# Altium project Adapter.PrjPCB
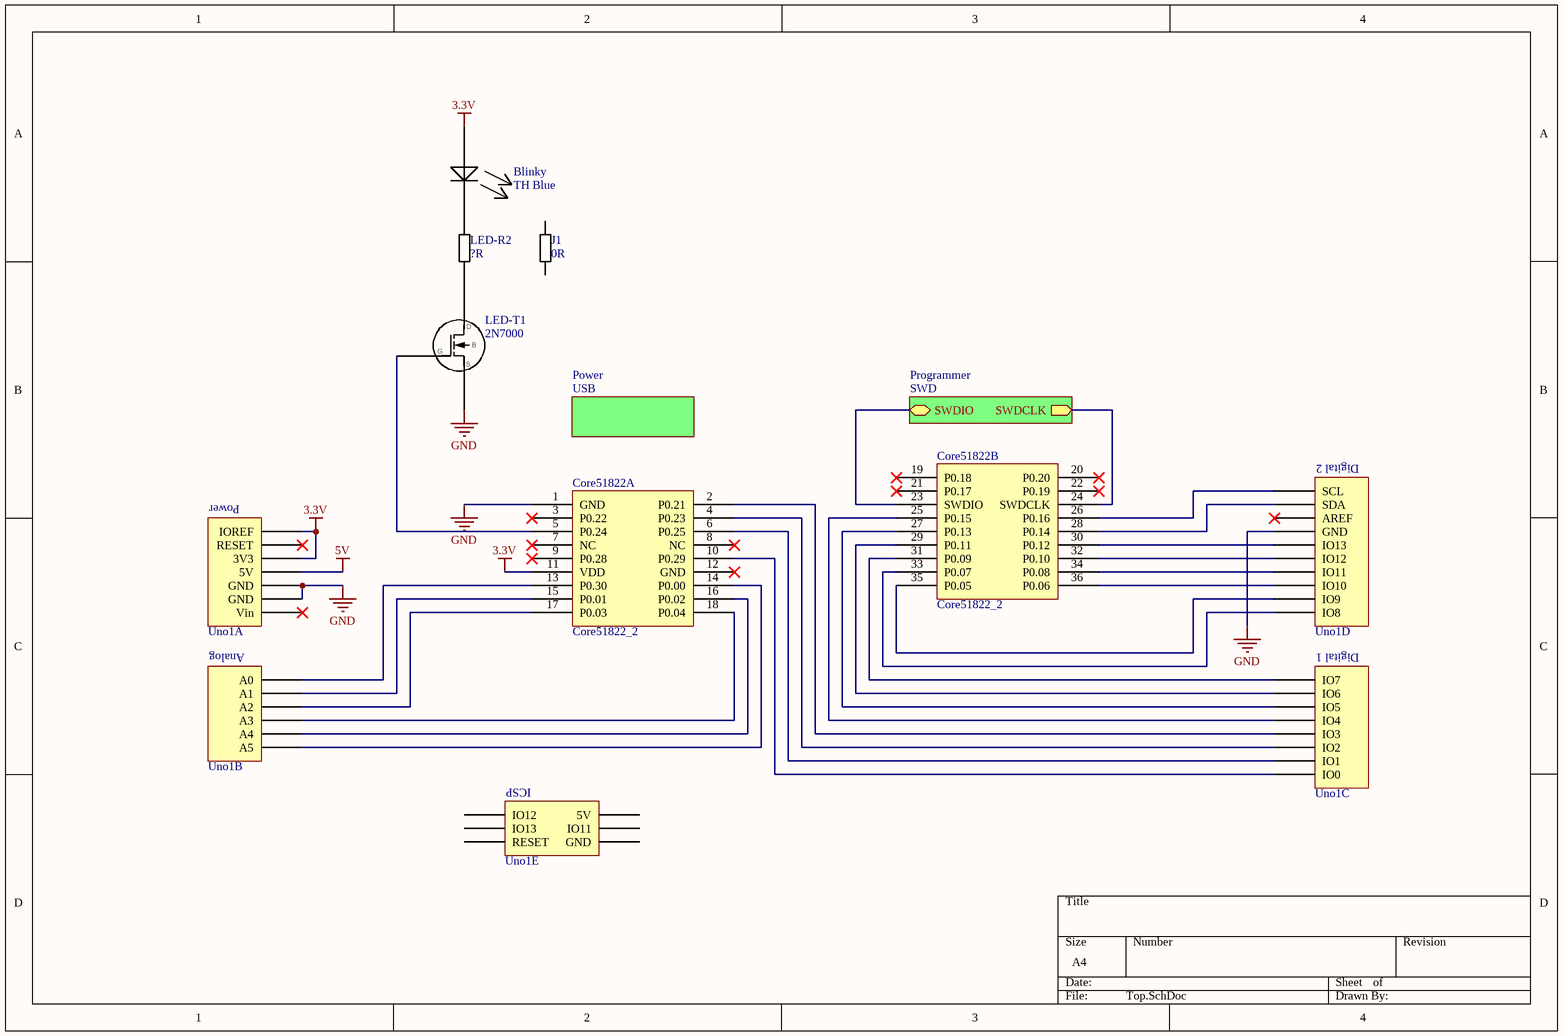
[diagram p0: Top.SchDoc]
4 sheets, 14 parts. Net scope: hierarchical (ports join the sheet entries above them; power ports are global).
Board file: DevBoard.PcbDoc
Sheets:
  Top.SchDoc
    USB = Power.SchDoc
      Voltage Regulator = LDO-3V3.SchDoc
  SWD resistor hack.SchDoc

## Sheet Top.SchDoc
size A4

### Parts
Blinky  TH Blue  [LED 3mm]
Core51822  Core51822_2  [Core51822]  (parts A,B of 2)
J1  0R  [R 0805 / 2012 wide]
LED-R2  ?R  [R 0805 / 2012]
LED-T1  2N7000  [SOT-23-3]
Uno1  Arduino Uno  [Arduino Uno Adapter]  (value not drawn)  (parts A,B,C,D,E of 5)

### Sub-sheets
Programmer = SWD (file not in this document): SWDCLK (out), SWDIO (bidir)
USB = Power: no entries

### Nets
3.3V: Blinky.1(+) Core51822.11(VDD) Uno1.3V3 Uno1.IOREF
5V: Uno1.5V
GND: Core51822.1(GND) LED-T1.2 Uno1.GND1(GND) Uno1.GND2(GND) Uno1.GND3(GND)
NetBlinky_2: Blinky.2(-) LED-R2.2
NetCore51822_2: Core51822.2(P0.21) Uno1.3(IO3)
NetCore51822_4: Core51822.4(P0.23) Uno1.2(IO2)
NetCore51822_5: Core51822.5(P0.24) LED-T1.1
NetCore51822_6: Core51822.6(P0.25) Uno1.1(IO1)
NetCore51822_10: Core51822.10(P0.29) Uno1.0(IO0)
NetCore51822_13: Core51822.13(P0.30) Uno1.A0
NetCore51822_14: Core51822.14(P0.00) Uno1.A5
NetCore51822_15: Core51822.15(P0.01) Uno1.A1
NetCore51822_16: Core51822.16(P0.02) Uno1.A4
NetCore51822_17: Core51822.17(P0.03) Uno1.A2
NetCore51822_18: Core51822.18(P0.04) Uno1.A3
NetCore51822_23: Core51822.23(SWDIO) ; sheet Programmer/SWDIO
NetCore51822_24: Core51822.24(SWDCLK) ; sheet Programmer/SWDCLK
NetCore51822_25: Core51822.25(P0.15) Uno1.4(IO4)
NetCore51822_26: Core51822.26(P0.16) Uno1.SCL
NetCore51822_27: Core51822.27(P0.13) Uno1.5(IO5)
NetCore51822_28: Core51822.28(P0.14) Uno1.SDA
NetCore51822_29: Core51822.29(P0.11) Uno1.6(IO6)
NetCore51822_30: Core51822.30(P0.12) Uno1.13(IO13)
NetCore51822_31: Core51822.31(P0.09) Uno1.7(IO7)
NetCore51822_32: Core51822.32(P0.10) Uno1.12(IO12)
NetCore51822_33: Core51822.33(P0.07) Uno1.8(IO8)
NetCore51822_34: Core51822.34(P0.08) Uno1.11(IO11)
NetCore51822_35: Core51822.35(P0.05) Uno1.9(IO9)
NetCore51822_36: Core51822.36(P0.06) Uno1.10(IO10)
NetLED-R2_1: LED-R2.1 LED-T1.3

Not connected (* = marked no-connect by the designer): Core51822 3(P0.22)* 7(NC)* 8(NC)* 9(P0.28)* 12(GND)* 19(P0.18)* 20(P0.20)* 21(P0.17)* 22(P0.19)*; J1 1 2; Uno1 AREF* ICSP1(IO12) ICSP2(5V) ICSP3(IO13) ICSP4(IO11) ICSP5(RESET) ICSP6(GND) RESET* Vin*

### Notes on the sheet
- (in symbol Arduino Uno, part A) Power
- (in symbol Arduino Uno, part B) Analog
- (in symbol Arduino Uno, part C) Digital 1
- (in symbol Arduino Uno, part D) Digital 2
- (in symbol Arduino Uno, part E) ICSP

### Library data of the parts
Blinky = LED
J1 LED-R2 = Resistor
LED-T1 = 2N7000: N-FET

## Sheet Power.SchDoc
size A4
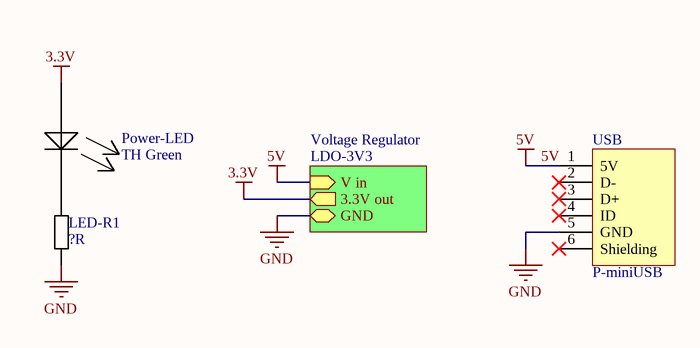
[diagram p1: Power.SchDoc]

### Parts
LED-R1  ?R  [R 0805 / 2012]
Power-LED  TH Green  [LED 3mm]
USB  P-miniUSB  [miniUSB]

### Sub-sheets
Voltage Regulator = LDO-3V3: 3.3V out (out), GND, V in (in)

### Nets
3.3V: Power-LED.1(+) ; sheet Voltage Regulator/3.3V out
5V: USB.1(5V) ; sheet Voltage Regulator/V in
GND: LED-R1.1 USB.5(GND) ; sheet Voltage Regulator/GND
NetLED-R1_2: LED-R1.2 Power-LED.2(-)

Not connected (* = marked no-connect by the designer): USB 2(D-)* 3(D+)* 4(ID)* 6(Shielding)*

### Library data of the parts
LED-R1 = Resistor
Power-LED = LED
USB = miniUSB

## Sheet LDO-3V3.SchDoc
size A4
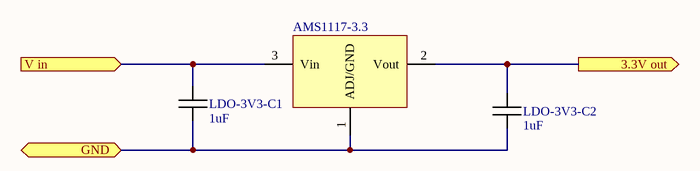
[diagram p2: LDO-3V3.SchDoc]

### Parts
AMS1117-3.3  AMS1117  [SOT-223-3]  (value not drawn)
LDO-3V3-C1  1uF  [C 0805 / 2012]
LDO-3V3-C2  1uF  [C 0805 / 2012]

### Ports
3.3V out (out), GND, V in (in)

### Nets
3.3V: AMS1117-3.3.2(Vout) LDO-3V3-C2.2 ; port 3.3V out
5V: AMS1117-3.3.3(Vin) LDO-3V3-C1.2 ; port V in
GND: AMS1117-3.3.1(ADJ/GND) LDO-3V3-C1.1 LDO-3V3-C2.1 ; port GND

### Library data of the parts
AMS1117-3.3 = AMS1117: LDO 3.3V/5V/12V
LDO-3V3-C1 LDO-3V3-C2 = Capacitor

## Sheet SWD resistor hack.SchDoc
size A4
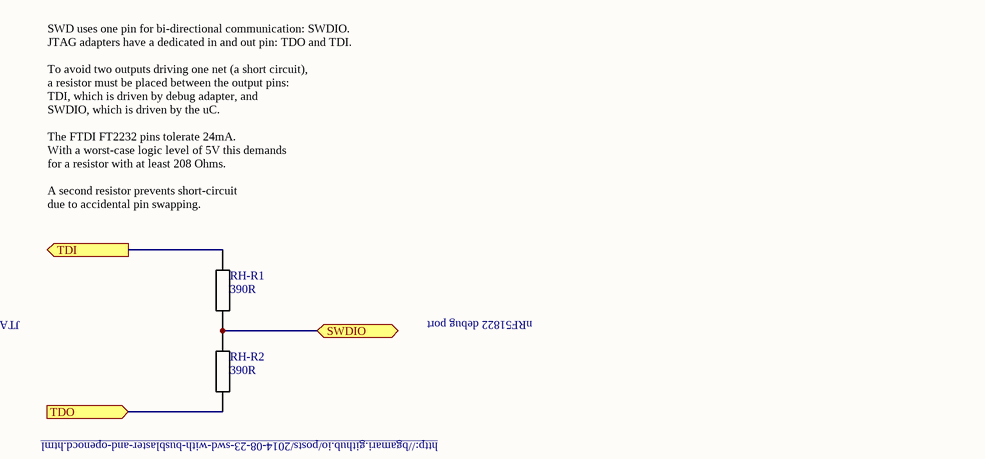
[diagram p3: SWD resistor hack.SchDoc]

### Parts
RH-R1  390R  [R 0805 / 2012 wide]
RH-R2  390R  [R 0805 / 2012 wide]

### Ports
SWDIO, TDI (out), TDO (in)

### Nets
NetRH-R1_1: RH-R1.1 RH-R2.2 ; port SWDIO
NetRH-R1_2: RH-R1.2 ; port TDI
NetRH-R2_1: RH-R2.1 ; port TDO

### Notes on the sheet
- (near RH-R1) SWD uses one pin for bi-directional communication: SWDIO.
  JTAG adapters have a dedicated in and out pin: TDO and TDI.
  To avoid two outputs driving one net (a short circuit),
  a resistor must be placed between the output pins:
  TDI, which is driven by debug adapter, and
  SWDIO, which is driven by the uC.
  The FTDI FT2232 pins tolerate 24mA.
  With a worst-case logic level of 5V this demands
  for a resistor with at least 208 Ohms.
  A second resistor prevents short-circuit
  due to accidental pin swapping.
- JTAG/SWD debug adapter
- nRF51822 debug port
- (near RH-R2) http://bgamari.github.io/posts/2014-08-23-swd-with-busblaster-and-openocd.html

### Library data of the parts
RH-R1 RH-R2 = Resistor

## Nets that join several sheets
3.3V: Top (Blinky.1 Core51822.11 Uno1.3V3 Uno1.IOREF), Power (Power-LED.1), LDO-3V3 (AMS1117-3.3.2 LDO-3V3-C2.2)
5V: Top (Uno1.5V), Power (USB.1), LDO-3V3 (AMS1117-3.3.3 LDO-3V3-C1.2)
GND: Top (5 pins), Power (LED-R1.1 USB.5), LDO-3V3 (AMS1117-3.3.1 LDO-3V3-C1.1 LDO-3V3-C2.1)